# Altium schematic sheet CubePilot and Motor Drivers.SchDoc
size A; SheetNumber: 3; SheetTotal: 5
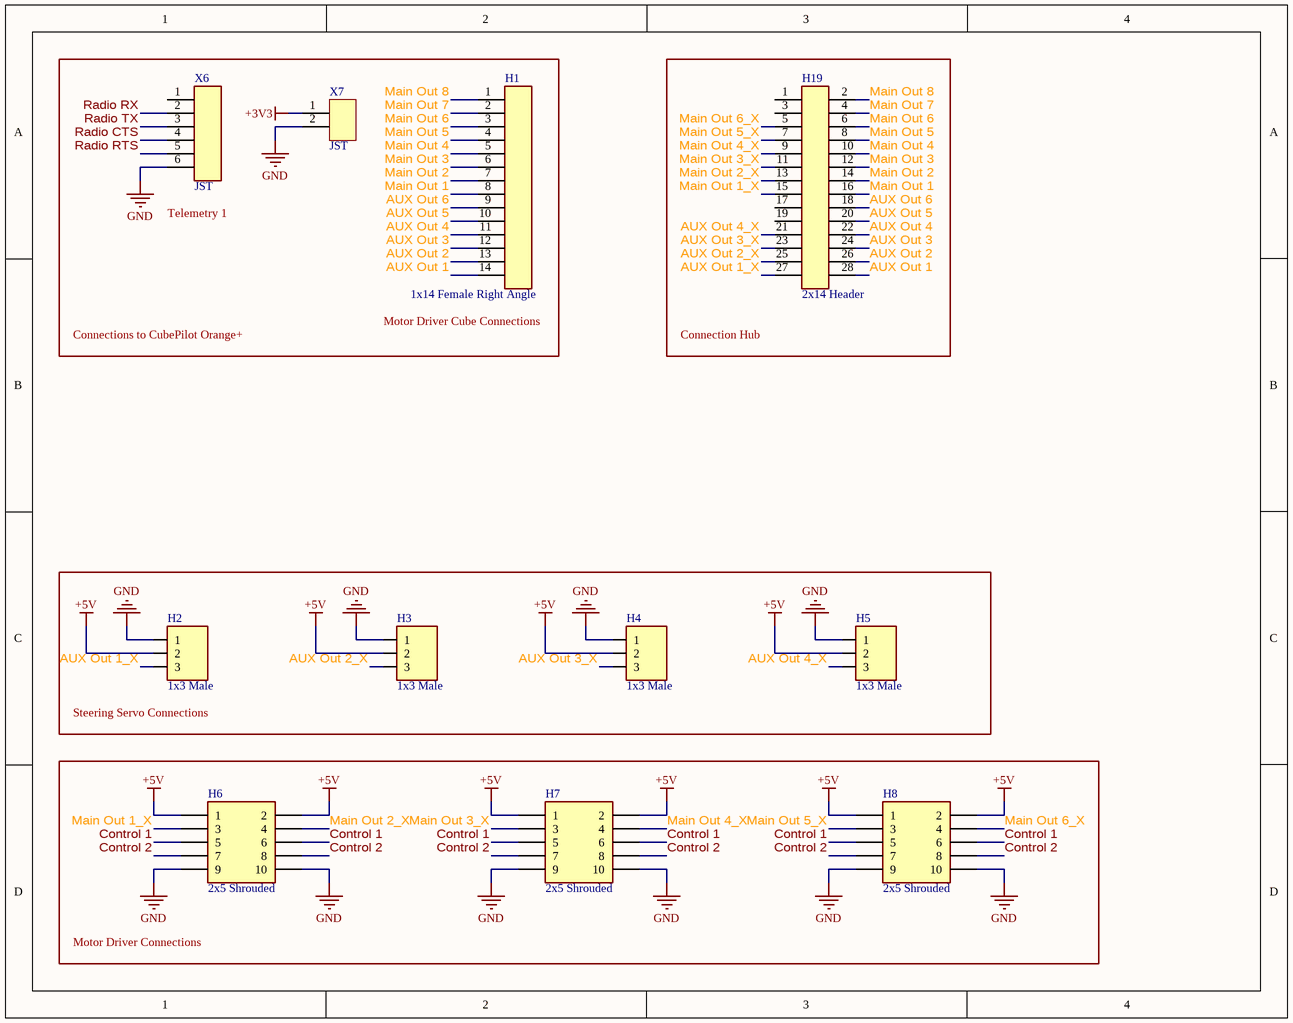
[diagram p0: CubePilot and Motor Drivers.SchDoc]

## Parts
H1  1x14 Female Right Angle  [[Header] 1x14 Right Angle Female]
H2  1x3 Male  [[Header] Shrouded 1x3 Male]
H3  1x3 Male  [[Header] Shrouded 1x3 Male]
H4  1x3 Male  [[Header] Shrouded 1x3 Male]
H5  1x3 Male  [[Header] Shrouded 1x3 Male]
H6  2x5 Shrouded  [[Header] Shrouded 2x5 Male]
H7  2x5 Shrouded  [[Header] Shrouded 2x5 Male]
H8  2x5 Shrouded  [[Header] Shrouded 2x5 Male]
H19  2x14 Header  [[Header] 2x14 Male]
X6  JST  [[JST] 6pin 2.54mm]
X7  JST  [[JST] 2PIN 2.54mm]

## Blocks framed on the sheet
Connection Hub: H19
Steering Servo Connections: H2-H5
Motor Driver Connections: H6-H8

## Nets
+3V3: X7.1
+5V: H2.2 H3.2 H4.2 H5.2 H6.1 H6.2 H7.1 H7.2 H8.1 H8.2
GND: H2.1 H3.1 H4.1 H5.1 H6.9 H6.10 H7.9 H7.10 H8.9 H8.10 X6.6 X7.2
AUX Out 1: H1.14 H19.28
AUX Out 1_X: H2.3 H19.27
AUX Out 2: H1.13 H19.26
AUX Out 2_X: H3.3 H19.25
AUX Out 3: H1.12 H19.24
AUX Out 3_X: H4.3 H19.23
AUX Out 4: H1.11 H19.22
AUX Out 4_X: H5.3 H19.21
AUX Out 5: H1.10 H19.20
AUX Out 6: H1.9 H19.18
Control 1: H6.5 H6.6 H7.5 H7.6 H8.5 H8.6
Control 2: H6.7 H6.8 H7.7 H7.8 H8.7 H8.8
Main Out 1: H1.8 H19.16
Main Out 1_X: H6.3 H19.15
Main Out 2: H1.7 H19.14
Main Out 2_X: H6.4 H19.13
Main Out 3: H1.6 H19.12
Main Out 3_X: H7.3 H19.11
Main Out 4: H1.5 H19.10
Main Out 4_X: H7.4 H19.9
Main Out 5: H1.4 H19.8
Main Out 5_X: H8.3 H19.7
Main Out 6: H1.3 H19.6
Main Out 6_X: H8.4 H19.5
Main Out 7: H1.2 H19.4
Main Out 8: H1.1 H19.2
Radio CTS: X6.4
Radio RTS: X6.5
Radio RX: X6.2
Radio TX: X6.3

Not connected (* = marked no-connect by the designer): H19 1 3 17 19; X6 1

## Notes on the sheet
- (near X6) Telemetry 1
- Connections to CubePilot Orange+
- (near H1) Motor Driver Cube Connections

## Library data of the parts
H1 = [Header] 1x14 Right Angle Female: 2.54mm pitch
H2-H5 = [Header] Shrouded 1x3 Male: 070543-0037 / Mates with 005057-9403; Supplier 1: DigiKey; Supplier Part Number 1: WM4825-ND
H6-H8 = [Header] Shrouded 2x5 Male: BHR-10-VUA
H19 = [Header] 2x14 Male: 2.54mm pitch
X6 = [JST] 6pin 2.54mm: 2.54mm pitch
X7 = [JST] 2pin 2.54mm: 2.54mm pitch